# Altium schematic sheet Nucleo.SchDoc: Persistence of Vision
size A4; Author: Nyiri Levente; Organization: BME_AUT; DocumentNumber: 2; Revision: 29; SheetNumber: 2; SheetTotal: 3
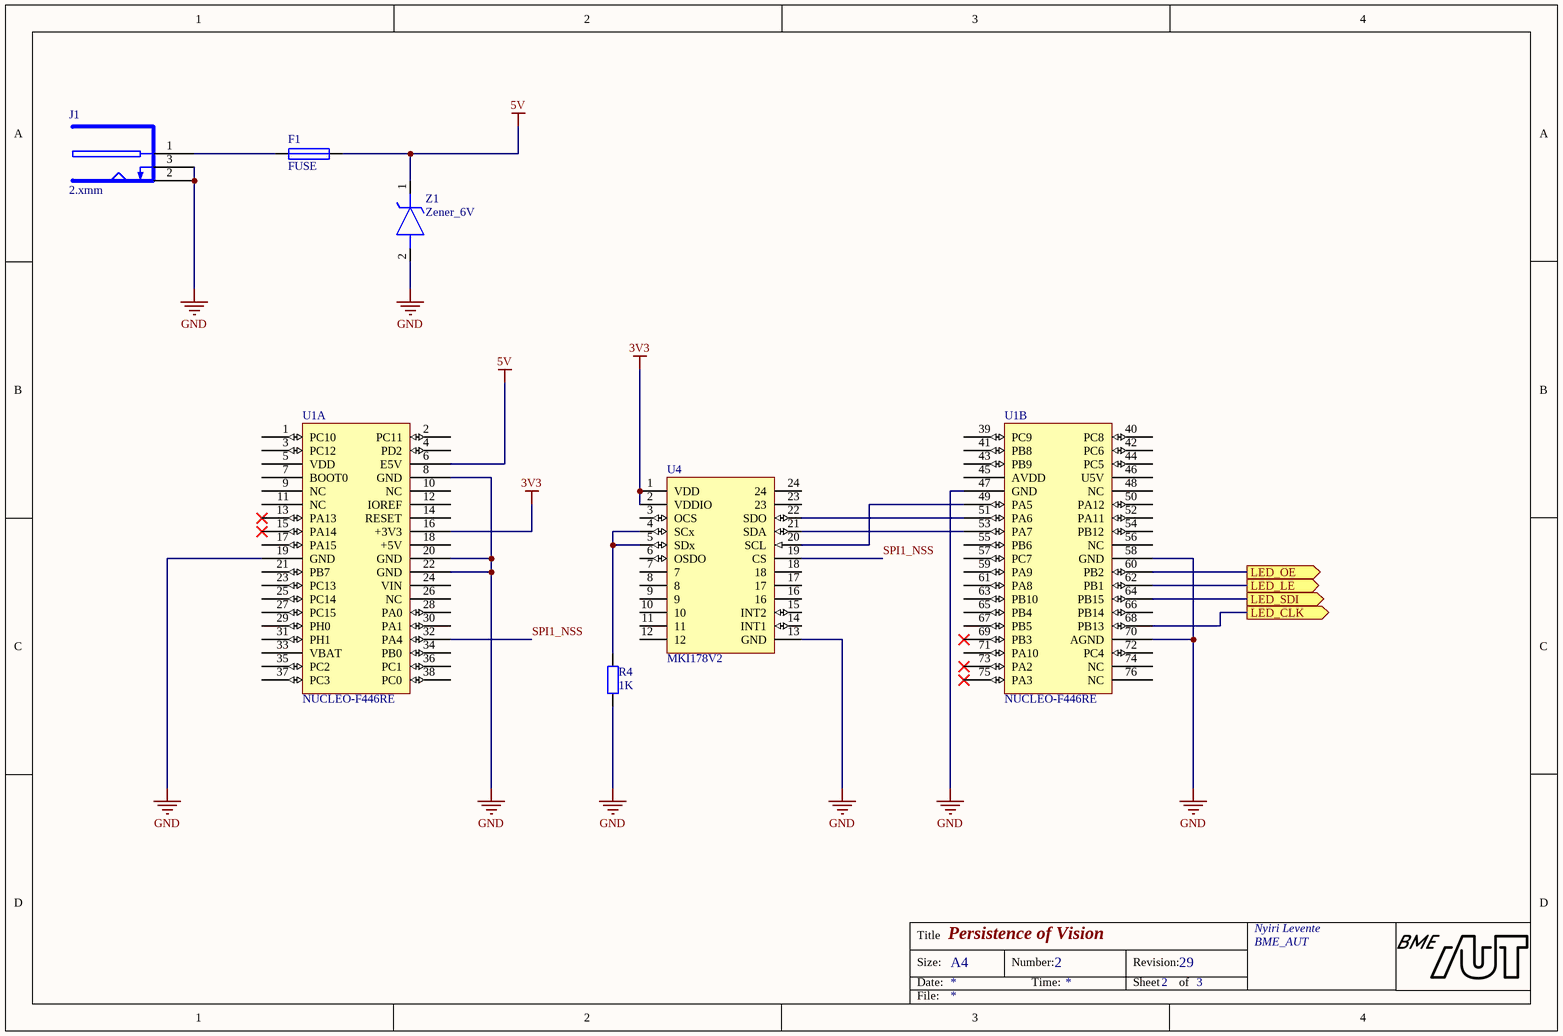
[diagram p0: Nucleo.SchDoc]

## Parts
F1  FUSE  [1812L125/16DR2.0]
J1  2.xmm  [FP_DC_TAP_ANYA]
R4  1K  [FP_0805_RES]
U1  NUCLEO-F446RE  [FP_NUCLEO-64_2x20]  (parts A,B of 2)
U4  MKI178V2  [FP_DIL24]
Z1  Zener_6V  [SOD2512X115N]

## Ports
LED_CLK (out), LED_LE (out), LED_OE (out), LED_SDI (out)

## Nets
3V3: U1.16(+3V3) U4.1(VDD) U4.2(VDDIO)
5V: F1.2 U1.6(E5V) Z1.1(K)
GND: J1.2(SLEEVE) J1.3(BREAK) R4.1 U1.8(GND) U1.19(GND) U1.20(GND) U1.22(GND) U1.47(GND) U1.58(GND) U1.70(AGND) U4.13(GND) Z1.2(A)
LED_CLK: U1.68(PB13) ; port LED_CLK
LED_LE: U1.62(PB1) ; port LED_LE
LED_OE: U1.60(PB2) ; port LED_OE
LED_SDI: U1.64(PB15) ; port LED_SDI
SPI1_NSS: U1.32(PA4) U4.19(CS)
NetF1_1: F1.1 J1.1(PIN)
NetR4_2: R4.2 U4.4(SCx) U4.5(SDx)
NetU1_49: U1.49(PA5) U4.20(SCL)
NetU1_51: U1.51(PA6) U4.22(SDO)
NetU1_53: U1.53(PA7) U4.21(SDA)

Not connected (* = marked no-connect by the designer): U1 1(PC10) 2(PC11) 3(PC12) 4(PD2) 5(VDD) 7(BOOT0) 9(NC) 10(NC) 11(NC) 12(IOREF) 13(PA13)* 14(RESET) 15(PA14)* 17(PA15) 18(+5V) 21(PB7) 23(PC13) 24(VIN) 25(PC14) 26(NC) 27(PC15) 28(PA0) 29(PH0) 30(PA1) 31(PH1) 33(VBAT) 34(PB0) 35(PC2) 36(PC1) 37(PC3) 38(PC0) 39(PC9) 40(PC8) 41(PB8) 42(PC6) 43(PB9) 44(PC5) 45(AVDD) 46(U5V) 48(NC) 50(PA12) 52(PA11) 54(PB12) 55(PB6) 56(NC) 57(PC7) 59(PA9) 61(PA8) 63(PB10) 65(PB4) 66(PB14) 67(PB5) 69(PB3)* 71(PA10) 72(PC4) 73(PA2)* 74(NC) 75(PA3)* 76(NC); U4 3(OCS) 6(OSDO) 7 8 9 10 11 12 14(INT1) 15(INT2) 16 17 18 23 24

## Notes on the sheet
- Title
- Size:
- Date:
- A4
- Number:
- Time:
- Revision:
- Sheet
- of
- File:

## Library data of the parts
F1 = 1812L125/16DR: PTC Resettable Fuse, 16V, Surface Mount; ComponentLink1URL: https://datasheet.ciiva.com:443/pdfs/VipMasterIC/IC/LFSI/LFSI-S-A0007892087/LFSI-S-A0007892087-1.pdf?src-supplier=IHS+Markit; ComponentLink1Description: https://datasheet.ciiva.com:443/pdfs/VipMasterIC/IC/LFSI/LFSI-S-A0007892087/LFSI-S-A0007892087-1.pdf?src-supplier=IHS+Markit; ComponentLink2URL: https://datasheet.ciiva.com/12541/littelfuse-ptc-1812l-12541791.pdf?src-supplier=Mouser; ComponentLink2Description: https://datasheet.ciiva.com/12541/littelfuse-ptc-1812l-12541791.pdf?src-supplier=Mouser; ComponentLink3URL: https://datasheet.ciiva.com/1273/48544-1273746.pdf?src-supplier=Element14; ComponentLink3Description: https://datasheet.ciiva.com/1273/48544-1273746.pdf?src-supplier=Element14; ComponentLink4URL: https://datasheet.ciiva.com/326/littelfuse-ptc-1812l-326975.pdf?src-supplier=Digikey; ComponentLink4Description: https://datasheet.ciiva.com/326/littelfuse-ptc-1812l-326975.pdf?src-supplier=Digikey; ComponentLink5URL: https://datasheet.ciiva.com/326/littelfuse-ptc-1812l-326976.pdf?src-supplier=Digikey; ComponentLink5Description: https://datasheet.ciiva.com/326/littelfuse-ptc-1812l-326976.pdf?src-supplier=Digikey; ComponentLink6URL: https://datasheet.ciiva.com/326/littelfuse-ptc-1812l-326977.pdf?src-supplier=Digikey; ComponentLink6Description: https://datasheet.ciiva.com/326/littelfuse-ptc-1812l-326977.pdf?src-supplier=Digikey; Supplier: Lomex; Reference: 44-04-71; Name: 1812L125/16DR
J1 = DC_TAP_ANYA: 2.xmm DC HEBA25 TÁPFESZÜLTSÉG ALJZAT ZÁRT, NYÁKBA 90°; Name: TÁP DC ANYA 5.5/2.1/9.5mm DCS-5521-5; Supplier: Lomex; Reference: 43-07-67
R4 = RES: Resistor; Name: CR-05JL7; Supplier: Lomex; Reference: 81-10-87
U1 = NUCLEO-F446RE: Reference: NUCLEO; Name: Nucleo F446RE; Supplier: Tanszék
U4 = MKI160V1: LSM6DS3 inertial module adapter; Reference: Tanszék; Name: MKI178V2; Supplier: ST
Z1 = BZT52C6V2S: Zener Diode; Supplier: Lomex; Reference: 85-02-89; Name: BZT52C6V2S